# Altium schematic sheet TitlePage.SchDoc: Title Page
size A4; DrawnBy: Patrik Staudenmayer; DocumentNumber: 1; SheetNumber: 1; SheetTotal: 15
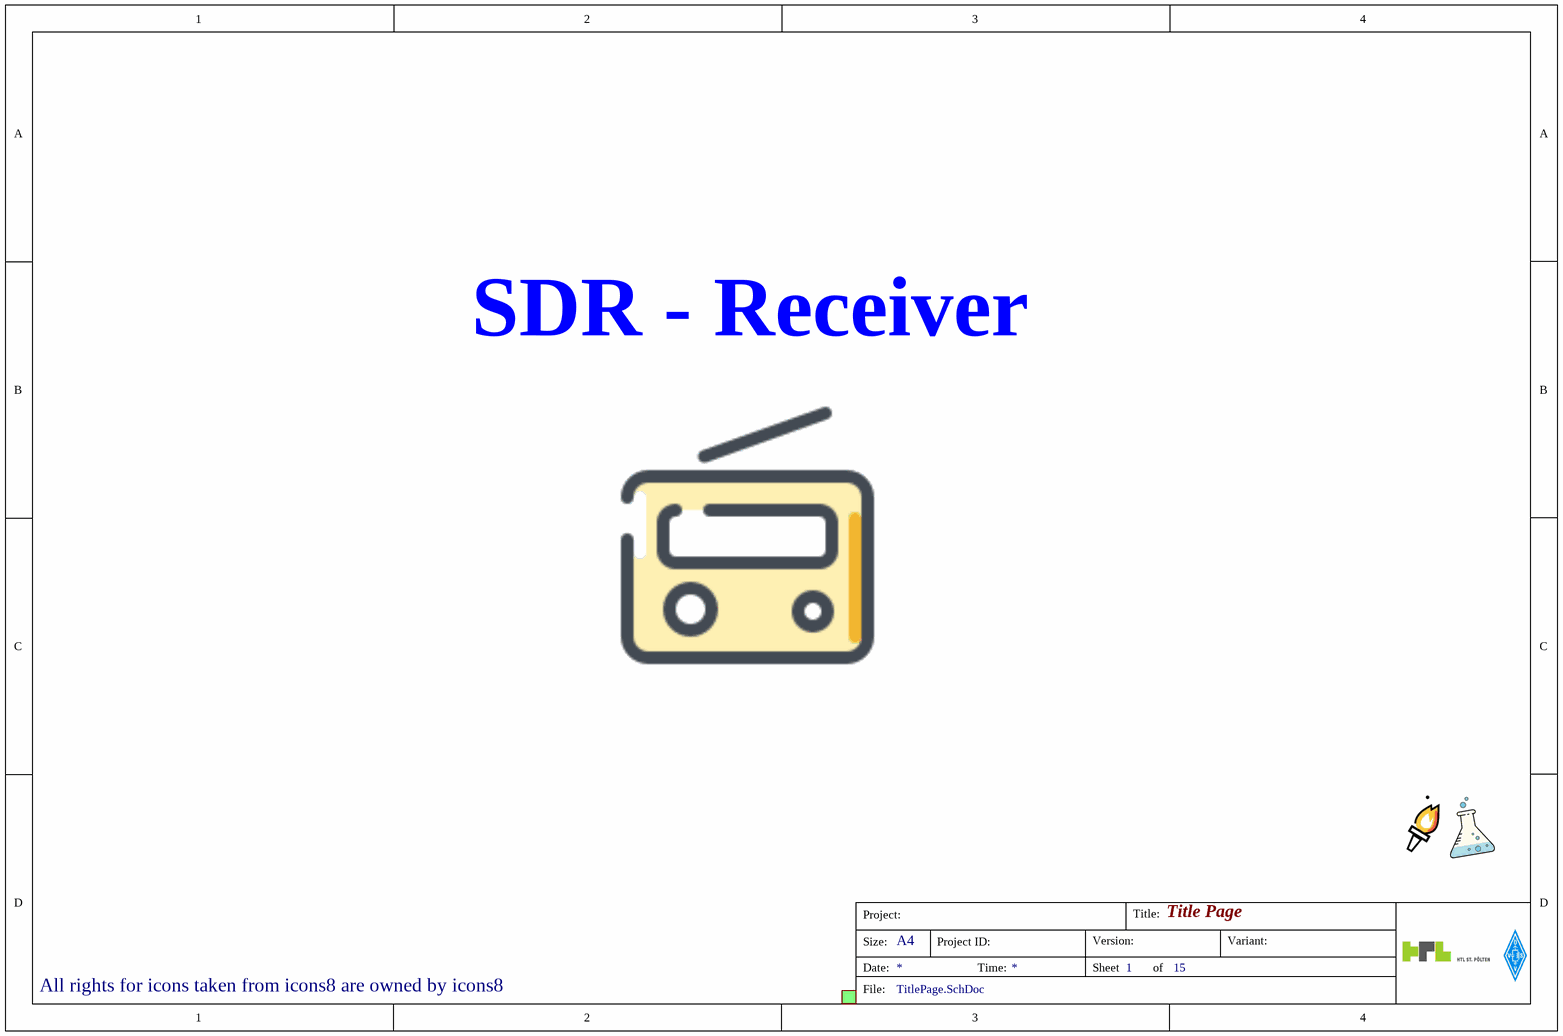
[diagram p0: TitlePage.SchDoc]

## Sub-sheets
Overview = Overview.SchDoc: no entries

## Notes on the sheet
- SDR - Receiver
- All rights for icons taken from icons8 are owned by icons8 <https://icons8.com>
- Project:
- Title:
- Size:
- Date:
- A4
- Project ID:
- Time:
- Sheet
- Version:
- of
- Variant:
- File: